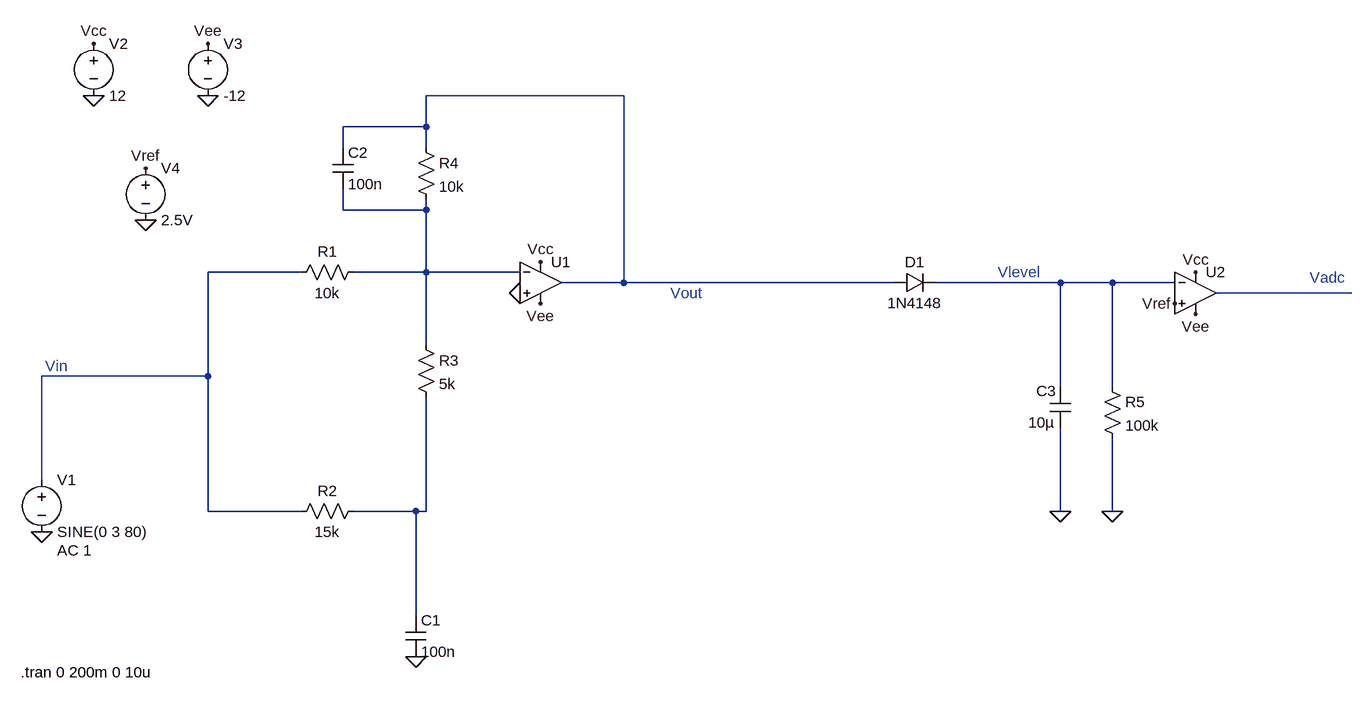
[diagram p0: schematic ltspice_schematic.asc]
ltspice_schematic.asc, the LTspice schematic file:
Version 4.1
SHEET 1 1940 680
WIRE 672 -320 368 -320
WIRE 368 -272 368 -320
WIRE 368 -272 240 -272
WIRE 240 -240 240 -272
WIRE 368 -240 368 -272
WIRE 240 -144 240 -176
WIRE 368 -144 368 -160
WIRE 368 -144 240 -144
WIRE 176 -48 32 -48
WIRE 368 -48 368 -144
WIRE 368 -48 256 -48
WIRE 512 -48 368 -48
WIRE 672 -32 672 -320
WIRE 672 -32 576 -32
WIRE 1088 -32 672 -32
WIRE 1344 -32 1152 -32
WIRE 1424 -32 1344 -32
WIRE 1520 -32 1424 -32
WIRE 1792 -16 1584 -16
WIRE 368 64 368 -48
WIRE 32 112 32 -48
WIRE 32 112 -224 112
WIRE 1344 128 1344 -32
WIRE 1424 128 1424 -32
WIRE -224 272 -224 112
WIRE 32 320 32 112
WIRE 176 320 32 320
WIRE 352 320 256 320
WIRE 368 320 368 144
WIRE 368 320 352 320
WIRE 1344 320 1344 192
WIRE 1424 320 1424 208
WIRE 352 480 352 320
FLAG -224 352 0
FLAG 352 544 0
FLAG 512 -16 0
FLAG -144 -320 0
FLAG -144 -400 Vcc
FLAG 544 -64 Vcc
FLAG 32 -320 0
FLAG 32 -400 Vee
FLAG 544 0 Vee
FLAG 1344 320 0
FLAG 1424 320 0
FLAG -64 -208 Vref
FLAG 1520 0 Vref
FLAG -64 -128 0
FLAG 1552 -48 Vcc
FLAG 1552 16 Vee
SYMBOL voltage -224 256 R0
WINDOW 123 24 124 Left 2
WINDOW 39 0 0 Left 0
SYMATTR Value2 AC 1
SYMATTR InstName V1
SYMATTR Value SINE(0 3 80)
SYMBOL res 272 -64 R90
WINDOW 0 0 56 VBottom 2
WINDOW 3 32 56 VTop 2
SYMATTR InstName R1
SYMATTR Value 10k
SYMBOL cap 336 480 R0
SYMATTR InstName C1
SYMATTR Value 100n
SYMBOL res 272 304 R90
WINDOW 0 0 56 VBottom 2
WINDOW 3 32 56 VTop 2
SYMATTR InstName R2
SYMATTR Value 15k
SYMBOL OpAmps\\UniversalOpAmp2 544 -32 R0
SYMATTR InstName U1
SYMBOL res 352 48 R0
SYMATTR InstName R3
SYMATTR Value 5k
SYMBOL res 352 -256 R0
SYMATTR InstName R4
SYMATTR Value 10k
SYMBOL voltage -144 -416 R0
SYMATTR InstName V2
SYMATTR Value 12
SYMBOL voltage 32 -416 R0
SYMATTR InstName V3
SYMATTR Value -12
SYMBOL cap 224 -240 R0
SYMATTR InstName C2
SYMATTR Value 100n
SYMBOL diode 1088 -16 R270
WINDOW 0 32 32 VTop 2
WINDOW 3 0 32 VBottom 2
SYMATTR InstName D1
SYMATTR Value 1N4148
SYMBOL res 1408 112 R0
SYMATTR InstName R5
SYMATTR Value 100k
SYMBOL cap 1328 128 R0
WINDOW 0 -21 7 Left 2
WINDOW 3 -33 55 Left 2
SYMATTR InstName C3
SYMATTR Value 10µ
SYMBOL voltage -64 -224 R0
WINDOW 123 0 0 Left 0
WINDOW 39 0 0 Left 0
SYMATTR InstName V4
SYMATTR Value 2.5V
SYMBOL OpAmps\\UniversalOpAmp2 1552 -16 R0
SYMATTR InstName U2
TEXT -184 96 Right 2 ;Vin
TEXT 744 -16 Left 2 ;Vout
TEXT 1248 -48 Left 2 ;Vlevel
TEXT -256 568 Left 2 !.tran 0 200m 0 10u
TEXT 1728 -40 Left 2 ;Vadc

The netlist it stands for:
* ltspice_schematic.asc
V1 N003 0 SINE(0 3 80) AC 1
R1 N002 N003 10k
C1 N006 0 100n
R2 N006 N003 15k
X§U1 0 N002 Vcc Vee N001 level2 Avol=1Meg GBW=10Meg Slew=10Meg Ilimit=25m Rail=0 Vos=0 En=0 Enk=0 In=0 Ink=0 Rin=500Meg  ; pins In+ In- V+ V- OUT
R3 N002 N006 5k
R4 N001 N002 10k
V2 Vcc 0 12
V3 Vee 0 -12
C2 N001 N002 100n
D1 N001 N004 1N4148
R5 N004 0 100k
C3 N004 0 10µ
V4 Vref 0 2.5V
X§U2 Vref N004 Vcc Vee N005 level2 Avol=1Meg GBW=10Meg Slew=10Meg Ilimit=25m Rail=0 Vos=0 En=0 Enk=0 In=0 Ink=0 Rin=500Meg  ; pins In+ In- V+ V- OUT
.model D D
.lib standard.dio
* Vin
* Vout
* Vlevel
.tran 0 200m 0 10u
* Vadc
.lib UniversalOpAmp2.lib
.backanno
.end